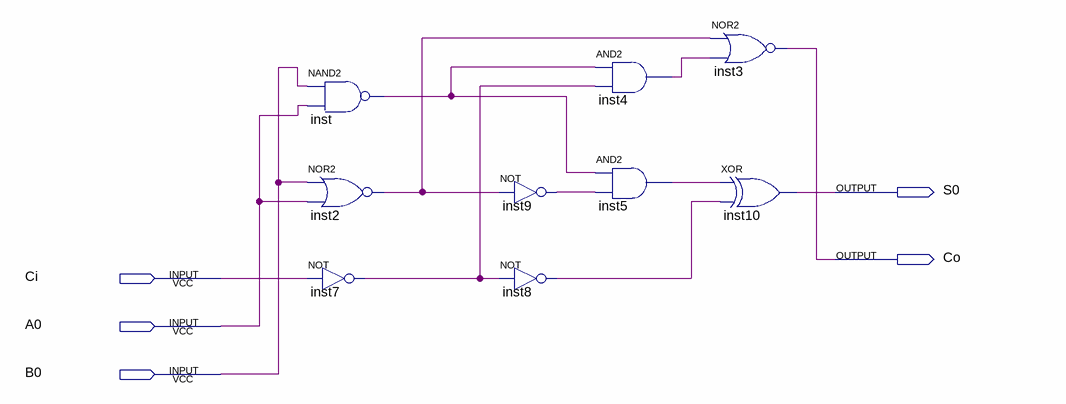
[diagram p0: schematic sheet]
// Quartus schematic 1bit_full_adder.bdf as structural Verilog: 9 symbols, 5 pins
module \1bit_full_adder  (
  input  Ci,
  input  A0,
  input  B0,
  output S0,
  output Co
);

  wire inst2_out, inst4_out, inst5_out, inst7_out, inst8_out, inst9_out, inst_out;

  nand inst (inst_out, B0, A0);
  nor inst2 (inst2_out, B0, A0);
  not inst7 (inst7_out, Ci);
  not inst9 (inst9_out, inst2_out);
  not inst8 (inst8_out, inst7_out);
  and inst4 (inst4_out, inst_out, inst7_out);
  and inst5 (inst5_out, inst_out, inst9_out);
  nor inst3 (Co, inst2_out, inst4_out);
  xor inst10 (S0, inst5_out, inst8_out);
endmodule
